# EAGLE schematic Esp32-S3mini_can brd_NEW (EAGLE 9.7.0)

## Sheet 1 of 2
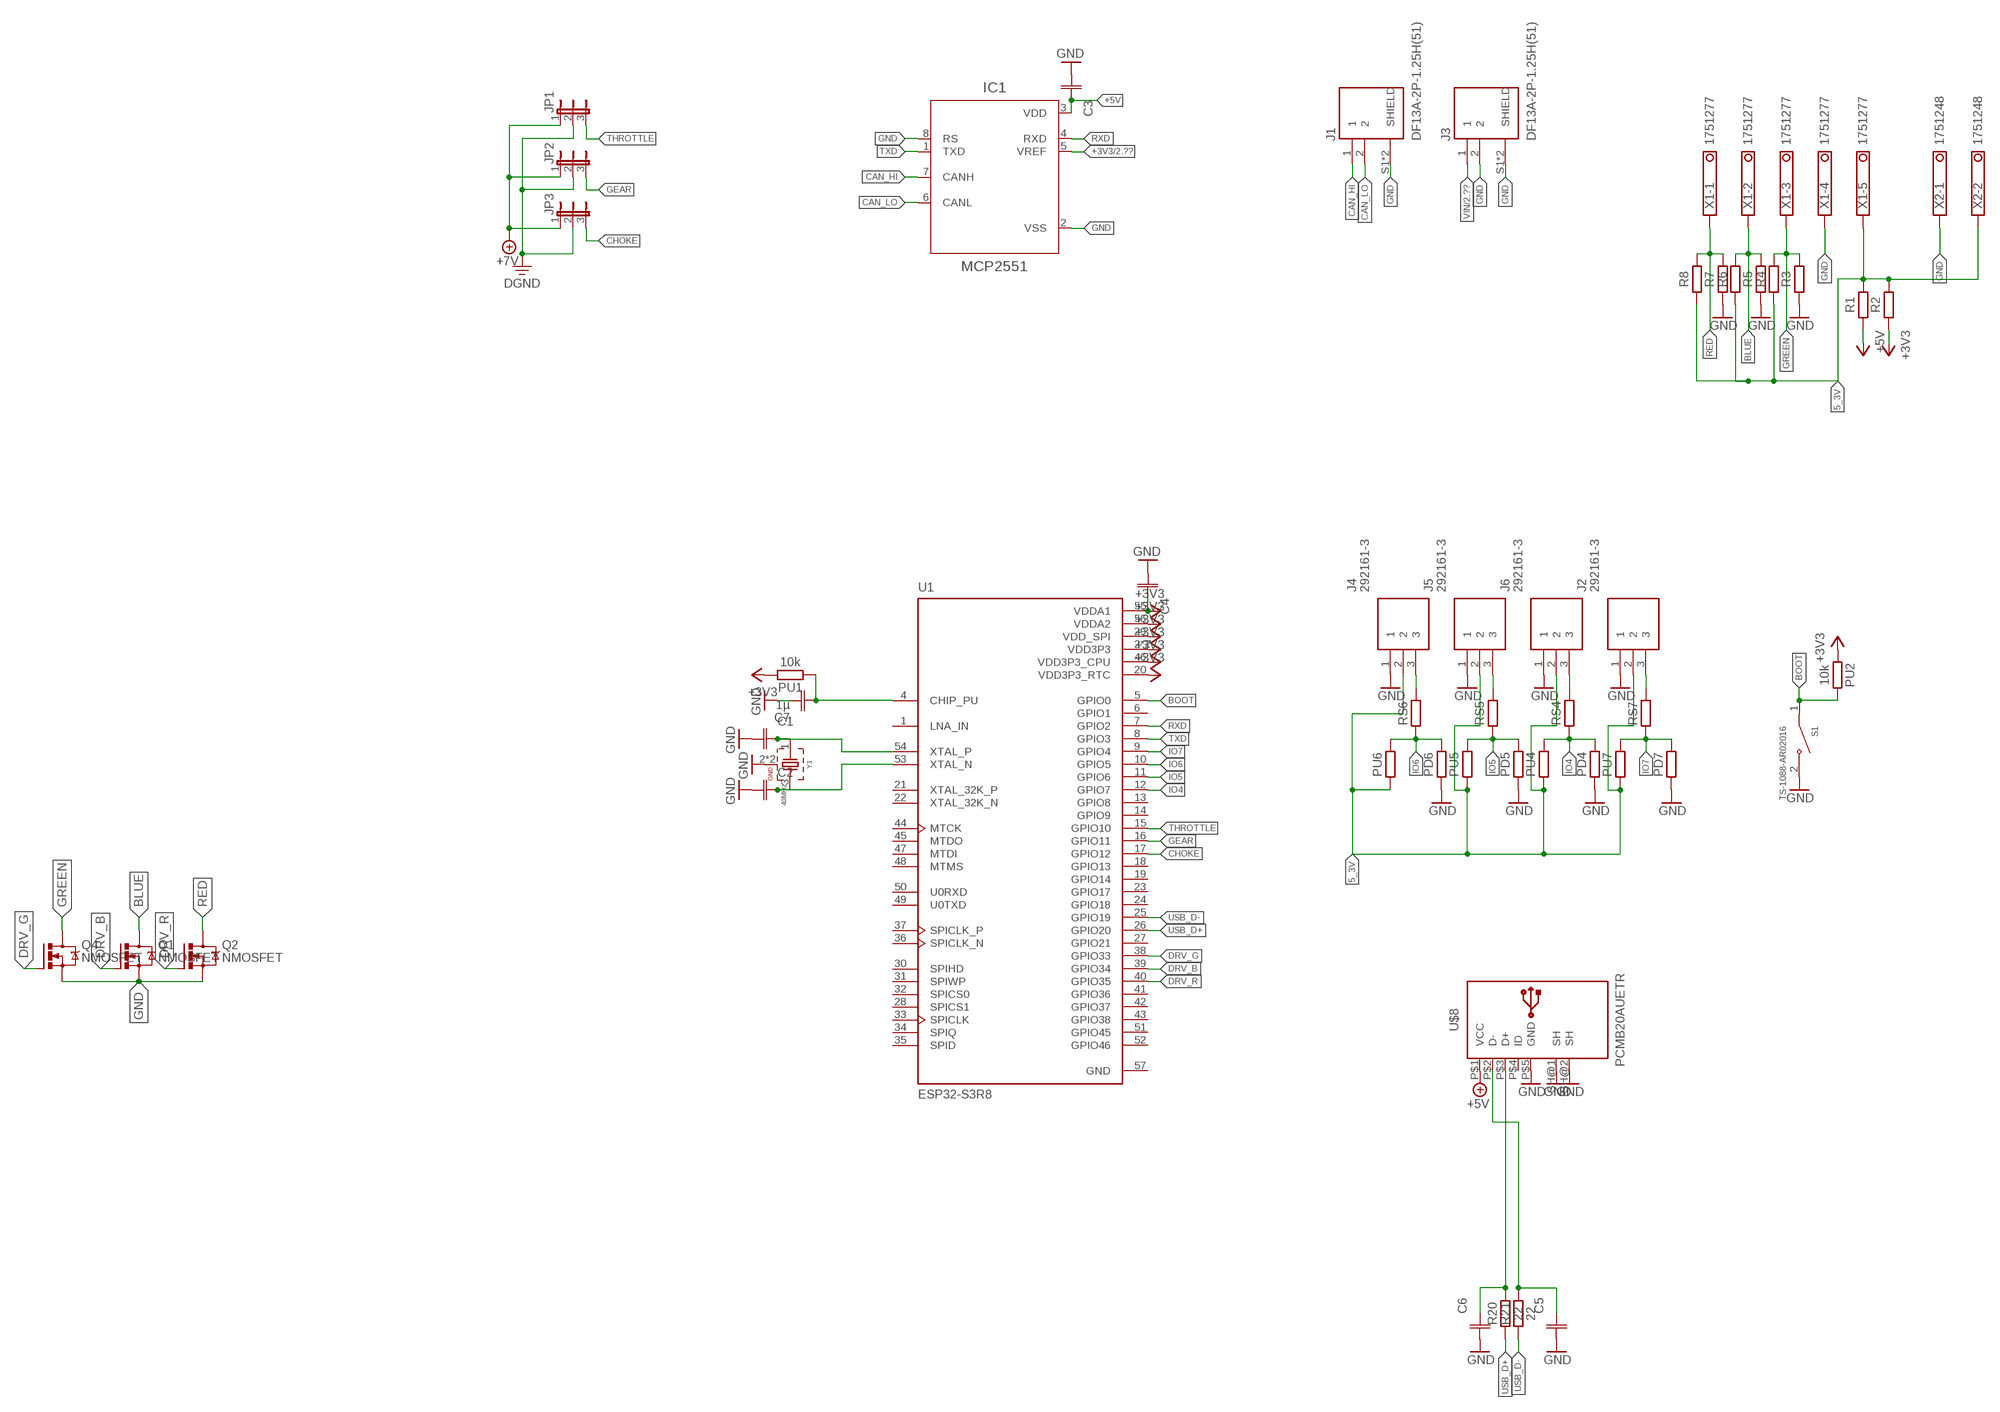
[diagram p0: schematic, sheet 1]

### Parts
C1  C_CHIP-0603(1608-METRIC)  [CAPC1608X85]
C2  C_CHIP-0603(1608-METRIC)  [CAPC1608X85]
C3  C_CHIP-0603(1608-METRIC)  [CAPC1608X85]
C4  C_CHIP-0603(1608-METRIC)  [CAPC1608X85]
C5  C_CHIP-0402(1005-METRIC)  [CAPC1005X60]
C6  C_CHIP-0402(1005-METRIC)  [CAPC1005X60]
C7  1µ  C_CHIP-0603(1608-METRIC)  [CAPC1608X85]
IC1  MCP2551  MCP2551_SOIC  [SOIC127P599X175-8]
J1  DF13A-2P-1.25H(51)  [HRS_DF13A-2P-1.25H(51)]
J2  292161-3  [SHDR3W60P0X200_1X3_780X360X680]
J3  DF13A-2P-1.25H(51)  [HRS_DF13A-2P-1.25H(51)]
J4  292161-3  [SHDR3W60P0X200_1X3_780X360X680]
J5  292161-3  [SHDR3W60P0X200_1X3_780X360X680]
J6  292161-3  [SHDR3W60P0X200_1X3_780X360X680]
JP1  JP2E  [JP2]
JP2  JP2E  [JP2]
JP3  JP2E  [JP2]
PD4  R_CHIP-0603(1608-METRIC)  [RESC1608X60]
PD5  R_CHIP-0603(1608-METRIC)  [RESC1608X60]
PD6  R_CHIP-0603(1608-METRIC)  [RESC1608X60]
PD7  R_CHIP-0603(1608-METRIC)  [RESC1608X60]
PU1  10k  R_CHIP-0603(1608-METRIC)  [RESC1608X60]
PU2  10k  R_CHIP-0603(1608-METRIC)  [RESC1608X60]
PU4  R_CHIP-0603(1608-METRIC)  [RESC1608X60]
PU5  R_CHIP-0603(1608-METRIC)  [RESC1608X60]
PU6  R_CHIP-0603(1608-METRIC)  [RESC1608X60]
PU7  R_CHIP-0603(1608-METRIC)  [RESC1608X60]
Q1  NMOSFET  NMOSFETSOT23-GSD  [SOT23]
Q2  NMOSFET  NMOSFETSOT23-GSD  [SOT23]
Q4  NMOSFET  NMOSFETSOT23-GSD  [SOT23]
R1  R_CHIP-0603(1608-METRIC)  [RESC1608X60]
R2  R_CHIP-0603(1608-METRIC)  [RESC1608X60]
R3  R_CHIP-0603(1608-METRIC)  [RESC1608X60]
R4  R_CHIP-0603(1608-METRIC)  [RESC1608X60]
R5  R_CHIP-0603(1608-METRIC)  [RESC1608X60]
R6  R_CHIP-0603(1608-METRIC)  [RESC1608X60]
R7  R_CHIP-0603(1608-METRIC)  [RESC1608X60]
R8  R_CHIP-0603(1608-METRIC)  [RESC1608X60]
R20  22  R_CHIP-0402(1005-METRIC)  [RESC1005X40]
R21  22  R_CHIP-0402(1005-METRIC)  [RESC1005X40]
RS4  R_CHIP-0603(1608-METRIC)  [RESC1608X60]
RS5  R_CHIP-0603(1608-METRIC)  [RESC1608X60]
RS6  R_CHIP-0603(1608-METRIC)  [RESC1608X60]
RS7  R_CHIP-0603(1608-METRIC)  [RESC1608X60]
S1  TS-1088-AR02016  [SW_TS-1088-AR02016]
U1  ESP32-S3R8  [QFN40P700X700X90-57N]
U$8  PCMB20AUETR  [PCMB20AUETR]
X1  1751277  [1751277]
X2  1751248  [1751248]
Y1  40MHz  WE-XTAL_IQXC-42_830059585  [WE-XTAL_IQXC-42]

### Nets
5_3V: J2.2 J4.2 J5.2 J6.2 PU4.1 PU5.1 PU6.1 PU7.1 R1.2 R2.2 R4.1 R6.1 R8.1 X1.5 X2.2
+3V3: C4.2 IC1.5(VREF) PU1.2 PU2.1 R2.1 U1.2(VDD3P3) U1.3(VDD3P3) U1.20(VDD3P3_RTC) U1.29(VDD_SPI) U1.46(VDD3P3_CPU) U1.55(VDDA1) U1.56(VDDA2) ; also sheet 2
+5V: C3.2 IC1.3(VDD) R1.1 U$8.P$1(VCC) ; also sheet 2
+7V: JP1.1 JP2.1 JP3.1 ; also sheet 2
BLUE: Q1.3(D) R5.2 R6.2 X1.2
BOOT: PU2.2 S1.1 U1.5(GPIO0)
CAN_HI: IC1.7(CANH) J1.1
CAN_LO: IC1.6(CANL) J1.2
CHOKE: JP3.3 U1.17(GPIO12)
DGND: JP1.2 JP2.2 JP3.2 ; also sheet 2
DRV_B: Q1.1(G) U1.39(GPIO34)
DRV_G: Q4.1(G) U1.38(GPIO33)
DRV_R: Q2.1(G) U1.40(GPIO35)
GEAR: JP2.3 U1.16(GPIO11)
GND: C1.1 C2.1 C3.1 C4.1 C5.1 C6.1 C7.2 IC1.2(VSS) IC1.8(RS) J1.S1(SHIELD) J1.S2(SHIELD) J2.1 J3.2 J3.S1(SHIELD) J3.S2(SHIELD) J4.1 J5.1 J6.1 PD4.1 PD5.1 PD6.1 PD7.1 Q1.2(S) Q2.2(S) Q4.2(S) R3.1 R5.1 R7.1 S1.2 U$8.P$5(GND) U$8.SH@1(SH) U$8.SH@2(SH) X1.4 X2.1 Y1.2(GND) Y1.4(GND) ; also sheet 2
GREEN: Q4.3(D) R3.2 R4.2 X1.3
IO4: PD4.2 PU4.2 RS4.1 U1.12(GPIO7)
IO5: PD5.2 PU5.2 RS5.1 U1.11(GPIO6)
IO6: PD6.2 PU6.2 RS6.1 U1.10(GPIO5)
IO7: PD7.2 PU7.2 RS7.1 U1.9(GPIO4)
N$3: C1.2 U1.54(XTAL_P) Y1.1
N$4: C2.2 U1.53(XTAL_N) Y1.3
N$7: C7.1 PU1.1 U1.4(CHIP_PU)
N$8: J6.3 RS4.2
N$10: C6.2 R20.2 U$8.P$3(D+)
N$11: C5.2 R21.2 U$8.P$2(D-)
N$12: J4.3 RS6.2
N$13: J5.3 RS5.2
N$14: J2.3 RS7.2
RED: Q2.3(D) R7.2 R8.2 X1.1
RXD: IC1.4(RXD) U1.7(GPIO2)
THROTTLE: JP1.3 U1.15(GPIO10)
TXD: IC1.1(TXD) U1.8(GPIO3)
USB_D+: R20.1 U1.26(GPIO20)
USB_D-: R21.1 U1.25(GPIO19)
VIN: J3.1 ; also sheet 2
Unconnected: U1.1(LNA_IN) U1.6(GPIO1) U1.13(GPIO8) U1.14(GPIO9) U1.18(GPIO13) U1.19(GPIO14) U1.21(XTAL_32K_P) U1.22(XTAL_32K_N) U1.23(GPIO17) U1.24(GPIO18) U1.27(GPIO21) U1.28(SPICS1) U1.30(SPIHD) U1.31(SPIWP) U1.32(SPICS0) U1.33(SPICLK) U1.34(SPIQ) U1.35(SPID) U1.36(SPICLK_N) U1.37(SPICLK_P) U1.41(GPIO36) U1.42(GPIO37) U1.43(GPIO38) U1.44(MTCK) U1.45(MTDO) U1.47(MTDI) U1.48(MTMS) U1.49(U0TXD) U1.50(U0RXD) U1.51(GPIO45) U1.52(GPIO46) U$8.P$4(ID)

## Sheet 2 of 2
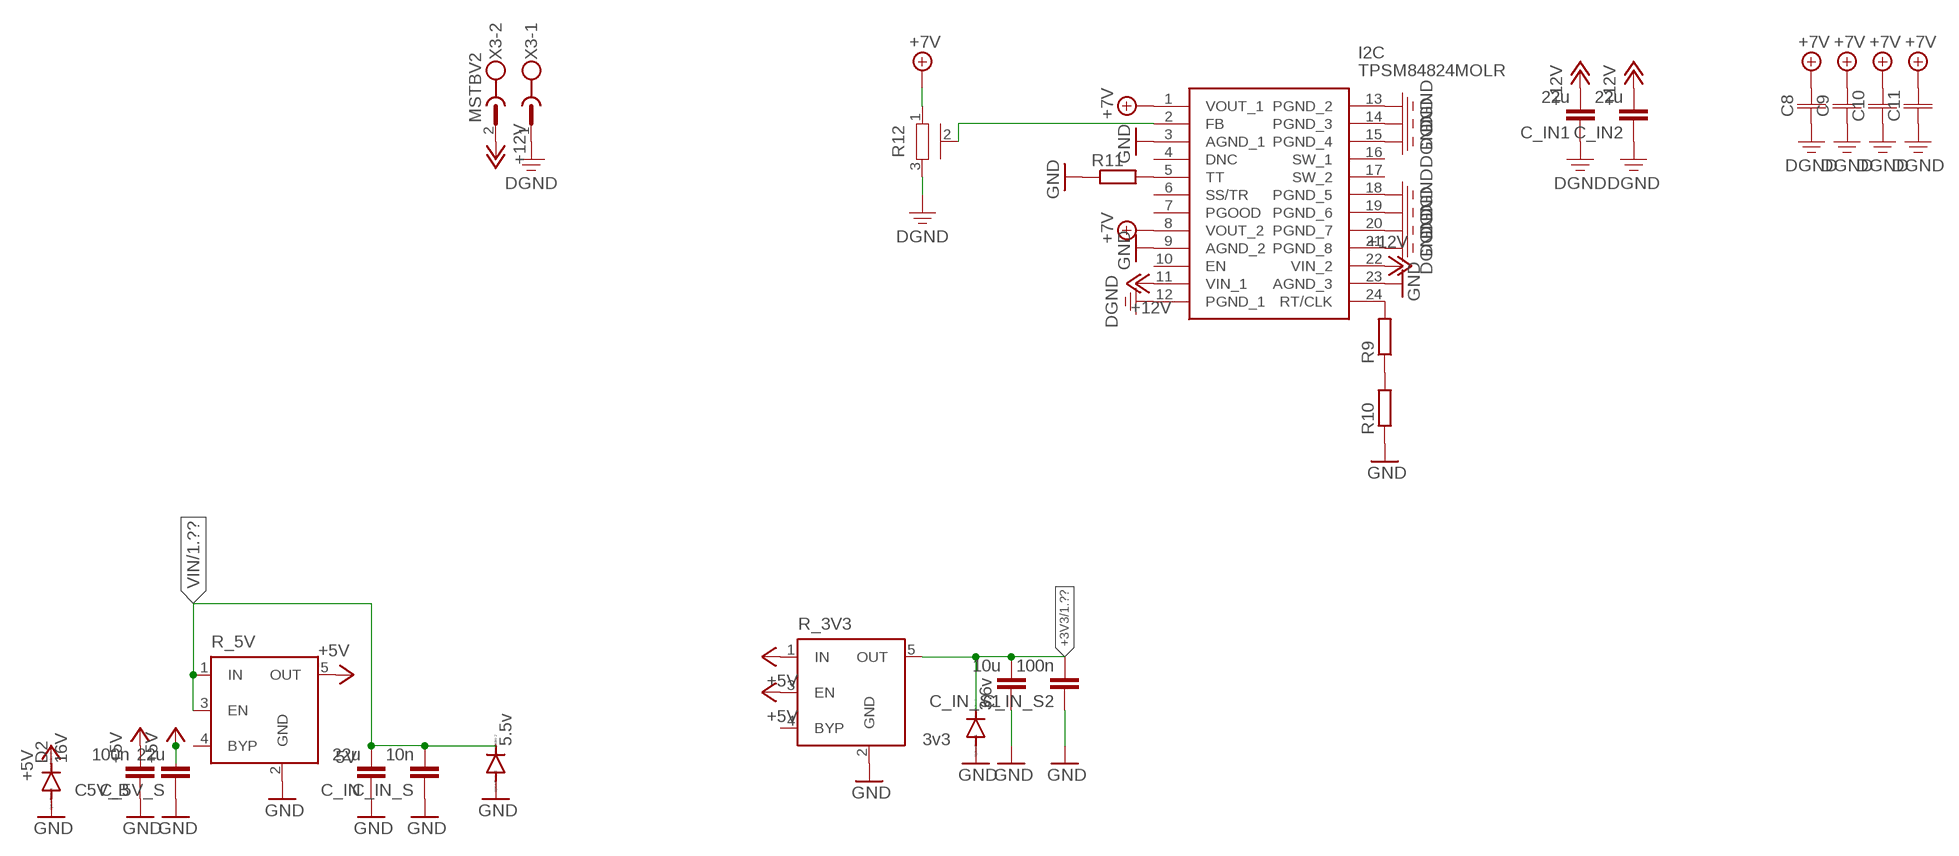
[diagram p1: schematic, sheet 2]

### Parts
C5V_B  100n  C-EUC0603  [C0603]
C8  C_CHIP-0805(2012-METRIC)  [CAPC2012X110]
C9  C_CHIP-0805(2012-METRIC)  [CAPC2012X110]
C10  C_CHIP-0805(2012-METRIC)  [CAPC2012X110]
C11  C_CHIP-0805(2012-METRIC)  [CAPC2012X110]
C_5V_S  22u  C-EUC1210K  [C1210K]
C_IN  22u  C-EUC1210K  [C1210K]
C_IN1  22u  C-EUC1210K  [C1210K]
C_IN2  22u  C-EUC1210K  [C1210K]
C_IN_S  10n  C-EUC0603  [C0603]
C_IN_S1  10u  C-EUC0603  [C0603]
C_IN_S2  100n  C-EUC0603  [C0603]
D1  5.5v  DIODE-SOD123  [SOD123]
D2  16V  DIODE-SOD123  [SOD123]
D3  3.6v  DIODE-SOD123  [SOD123]
I2C  TPSM84824MOLR  [TPSM84624MOLR]
R9  R-EU_R0603  [R0603]
R10  R-EU_R0603  [R0603]
R11  R-EU_R0603  [R0603]
R12  PV36W  [PV36W]
R_3V3  3v3  MIC5219XX  [SOT23-5]
R_5V  5V  MIC5219XX  [SOT23-5]
X3  MSTBV2  [MSTBV2]

### Nets
+3V3: C_IN_S1.2 C_IN_S2.2 D3.C R_3V3.5(OUT) ; also sheet 1
+5V: C5V_B.2 C_5V_S.2 D2.C R_3V3.1(IN) R_3V3.3(EN) R_5V.5(OUT) ; also sheet 1
+7V: C8.2 C9.2 C10.2 C11.2 I2C.1(VOUT_1) I2C.8(VOUT_2) R12.1 ; also sheet 1
+12V: C_IN1.2 C_IN2.2 I2C.11(VIN_1) I2C.22(VIN_2) X3.2
DGND: C8.1 C9.1 C10.1 C11.1 C_IN1.1 C_IN2.1 I2C.12(PGND_1) I2C.13(PGND_2) I2C.14(PGND_3) I2C.15(PGND_4) I2C.18(PGND_5) I2C.19(PGND_6) I2C.20(PGND_7) I2C.21(PGND_8) R12.3 X3.1 ; also sheet 1
GND: C5V_B.1 C_5V_S.1 C_IN.1 C_IN_S1.1 C_IN_S2.1 C_IN_S.1 D1.A D2.A D3.A I2C.3(AGND_1) I2C.9(AGND_2) I2C.23(AGND_3) R10.1 R11.1 R_3V3.2(GND) R_5V.2(GND) ; also sheet 1
N$6: I2C.24(RT/CLK) R9.2
N$9: R9.1 R10.2
N$15: I2C.2(FB) R12.2
N$16: I2C.5(TT) R11.2
VIN: C_IN.2 C_IN_S.2 D1.C R_5V.1(IN) R_5V.3(EN) ; also sheet 1
Unconnected: I2C.4(DNC) I2C.6(SS/TR) I2C.7(PGOOD) I2C.10(EN) I2C.16(SW_1) I2C.17(SW_2) R_3V3.4(BYP) R_5V.4(BYP)

## Power pins joined to a net without a drawn wire
GND: U1.57(GND)

## Library data of the parts
C1-C4 C7 = Capacitor:C: Capacitor - Generic; CATEGORY: Capacitor; PACKAGE_SIZE: 0603; PACKAGE_TYPE: Surface Mount; SUBCATEGORY: Ceramic Capacitors; TYPE: MLCC
C5 C6 = Capacitor:C: Capacitor - Generic; CATEGORY: Capacitor; PACKAGE_SIZE: 0402; PACKAGE_TYPE: Surface Mount; SUBCATEGORY: Ceramic Capacitors; TYPE: MLCC
C5V_B C_5V_S C_IN C_IN1 C_IN2 C_IN_S C_IN_S1 C_IN_S2 = rcl:C-EU: CAPACITOR, European symbol; SPICEPREFIX: C
C8-C11 = Capacitor:C: Capacitor - Generic; CATEGORY: Capacitor; PACKAGE_SIZE: 0805; PACKAGE_TYPE: Surface Mount; SUBCATEGORY: Ceramic Capacitors; TYPE: MLCC
D1-D3 = diode:DIODE-: DIODE
I2C = TPSM84824MOLR:TPSM84824MOLR: 4.5V to 17V Input, 0.6V-10V Output, 8A Power Module in Compact 7.5x7.5mm Footprint Source: Datasheet <http://www.ti.com/lit/gpn/tpsm84824>; ARROW_PART_NUMBER: TPSM84824MOLR; ARROW_PRICE-STOCK: https://www.arrow.com/en/products/tpsm84824molr/texas-instruments?region=nac; DESCRIPTION: 4.5V to 17V Input, 0.6V-10V Output, 8A Power Module in Compact 7.5x7.5mm Footprint; HEIGHT: 5mm; MANUFACTURER_NAME: Texas Instruments; MANUFACTURER_PART_NUMBER: TPSM84824MOLR; MOUSER_PART_NUMBER: 595-TPSM84824MOLR; MOUSER_PRICE-STOCK: https://www.mouser.co.uk/ProductDetail/Texas-Instruments/TPSM84824MOLR?qs=W0yvOO0ixfEo%2FgpT5Em6eQ%3D%3D
IC1 = IC_Interface:MCP2551: High - Speed CAN Transceiver Datasheet <http://ww1.microchip.com/downloads/en/devicedoc/20001667g.pdf>; CATEGORY: IC_Interface; MANUFACTURER: Microchip; MPN: MCP2551-E/SN; OPERATING_TEMP: -40 to +125 °C; PART_STATUS: Active; SUB-CATEGORY: Transceiver
J1 J3 = DF13A-2P-1.25H_51_:DF13A-2P-1.25H(51): Check availability <https://pricing.snapeda.com/parts/DF13A-2P-1.25H%2851%29/Hirose%20Electric%20Co%20Ltd/view-part?ref=eda>; AVAILABILITY: In Stock; CHECK_PRICES: https://www.snapeda.com/parts/DF13A-2P-1.25H(51)/Hirose+Electric+Co+Ltd/view-part/?ref=eda; DESCRIPTION: Connector Header Surface Mount, Right Angle 2 position 0.049 (1.25mm); MF: Hirose Electric Co Ltd; MP: DF13A-2P-1.25H(51); PACKAGE: None; PRICE: None; PURCHASE-URL: https://www.snapeda.com/api/url_track_click_mouser/?unipart_id=4701063&manufacturer=Hirose Electric Co Ltd&part_name=DF13A-2P-1.25H(51)&search_term=None; SNAPEDA_LINK: https://www.snapeda.com/parts/DF13A-2P-1.25H(51)/Hirose+Electric+Co+Ltd/view-part/?ref=snap
J2 J4-J6 = TE 292161-3:292161-3: AMP - TE CONNECTIVITY - 292161-3 - HEADER, VERTICAL, 3WAY Source: Datasheet <http://www.te.com/commerce/DocumentDelivery/DDEController?Action=showdoc&DocId=Customer Drawing292161P1pdfEnglishENG_CD_292161_P1.pdf292161-3>; ARROW_PART_NUMBER: 292161-3; ARROW_PRICE-STOCK: https://www.arrow.com/en/products/292161-3/te-connectivity?region=europe; DESCRIPTION: AMP - TE CONNECTIVITY - 292161-3 - HEADER, VERTICAL, 3WAY; HEIGHT: 6.8mm; MANUFACTURER_NAME: TE Connectivity; MANUFACTURER_PART_NUMBER: 292161-3; MOUSER_PART_NUMBER: 571-292161-3; MOUSER_PRICE-STOCK: https://www.mouser.co.uk/ProductDetail/TE-Connectivity/292161-3?qs=VKrXD49J9Epm0cTL0dEucA%3D%3D
JP1-JP3 = jumper:JP2E: JUMPER
PD4-PD7 PU1 PU2 PU4-PU7 R1-R8 R20 R21 RS4-RS7 = Resistor:R: Resistor Fixed - Generic; CATEGORY: Resistor; SUB-CATEGORY: Fixed
Q1 Q2 Q4 = Transistor:NMOSFET: N-Channel MOSFET - Generic; CATEGORY: Transistor; SUB-CATEGORY: MOSFET; TYPE: N-Channel
R9-R11 = MP930_res:R-EU_: RESISTOR, European symbol
R12 = Resistor:PV36: Rectangular Trimmer Potentiometers - PV36 Series Reference: Datasheet <https://www.bourns.com/docs/Product-Datasheets/pv36.pdf>; CATEGORY: Potentiometers; DATASHEET: https://www.bourns.com/docs/Product-Datasheets/pv36.pdf; DESCRIPTION: 0.5W 1/2W PC Pins Through Hole Trimmer Potentiometer Cermet 25.0 Turn Top Adjustment; MANUFACTURER: Bourns Inc.; MPN: PV36Wx; OPERATING_TEMPERATURE: -55°C ~ 125°C; PACKAGE_SIZE: NA; PACKAGE_TYPE: Through Hole; PART_STATUS: Active; ROHS: Compliant; SERIES: PV36; SUBCATEGORY: Trimmer Potentiometers; TEMPERATURE_COEFFICIENT: ±100ppm/°C; THERMALLOSS: 0.5 W; TOLERANCE: ±10%; TYPE: Top Adjustment Inline Leads
R_3V3 R_5V = v-reg-micrel:MIC5219XX: VOLTAGE REGULATOR; OC_FARNELL: unknown; OC_NEWARK: unknown
S1 = JLC PCB Basic Parts_loc:TS-1088-AR02016: Check availability <https://pricing.snapeda.com/parts/TS-1088-AR02016/Xunpu/view-part?ref=eda>; AVAILABILITY: Not in stock; CHECK_PRICES: https://www.snapeda.com/parts/TS-1088-AR02016/Xunpu/view-part/?ref=eda; DESCRIPTION: 50mA 4mm 100MΩ 100,000 Times 12V 160gf 3mm 2mm Round Button Vertical welding SPST SMD Tactile Switches ROHS; MF: Xunpu; MP: TS-1088-AR02016; PACKAGE: Package; PRICE: None; SNAPEDA_LINK: https://www.snapeda.com/parts/TS-1088-AR02016/Xunpu/view-part/?ref=snap
U1 = JLC PCB Basic Parts_loc:ESP32-S3R8: Check availability <https://pricing.snapeda.com/parts/ESP32-S3R8/Espressif%20Systems/view-part?ref=eda>; AVAILABILITY: In Stock; CHECK_PRICES: https://www.snapeda.com/parts/ESP32-S3R8/Espressif+Systems/view-part/?ref=eda; DESCRIPTION: IC RF TxRx + MCU Bluetooth, WiFi 802.11b/g/n, Bluetooth v5.0 2.412GHz ~ 2.484GHz 56-VFQFN Exposed Pad; MF: Espressif Systems; MP: ESP32-S3R8; PACKAGE: None; PRICE: None; SNAPEDA_LINK: https://www.snapeda.com/parts/ESP32-S3R8/Espressif+Systems/view-part/?ref=snap
U$8 = Library:PCMB20AUETR
X1 = con-phoenix-350:1751277: MKDS 1/ 5-3,5 Printklemme Nennstrom: 10 A Bemessungsspannung: 160 V Raster: 3,5 mm Polzahl: 5 Montageart: Löten Anschlussart: Schraubanschluss Anschlussrichtung vom Leiter zur Platine: 0° Source: http://eshop.phoenixcontact.com .. 1751277.pdf; OC_FARNELL: unknown; OC_NEWARK: unknown
X2 = con-phoenix-350:1751248: MKDS 1/ 2-3,5 Printklemme Nennstrom: 10 A Bemessungsspannung: 160 V Raster: 3,5 mm Polzahl: 2 Montageart: Löten Anschlussart: Schraubanschluss Anschlussrichtung vom Leiter zur Platine: 0° Source: http://eshop.phoenixcontact.com .. 1751248.pdf; OC_FARNELL: unknown; OC_NEWARK: unknown
X3 = Most_used_libr:MSTBV2: PHOENIX; MPN: MSTBV 2,5/2-GF-5.08; OC_FARNELL: 1792792; OC_NEWARK: 69R9845
Y1 = Wurth_Quartz Crystals &amp; Oscillators_WE-XTAL:WE-XTAL_IQXC-42: WE-XTAL Quartz Crystal Characteristics SMT and THT models Hermetically sealed Frequencies between 1.8432 MHz and 50 MHz Tolerances down to ±10 ppm available Maximum operating temperatures range: -40 °C to 85 °C Stabilities down to ±10 ppm available Applications Microprocessor Wireless Communication Devices Industrial Devices Wired Communication (e.g. Ethernet and USB) IoT Optical Network Audio and Multimedia Devices Test and Measurement Equipment Navigation and Locators Wearables <https://www.we-online.com/catalog/media/o135919v209%20Family_WE-XTAL_IQXC-42.jpg> Details see: https://www.we-online.com/catalog/en/WE-XTAL Updated by Ella Wu , 2020-11-23 2020 (C) Wurth Elektronik; C-LOAD: 10pF; DATASHEET-URL: https://www.we-online.com/catalog/datasheet/830059585.pdf; MOUNT: SMT; PART-NUMBER: 830059585; STABILITY: 20ppm; TOLERANCE: ±15ppm; VALUE: 20MHz